# Altium schematic sheet Camera_Shield_Headers.SchDoc: Shield Headers
size B; CompanyName: Cospan Design; DrawnBy: David McCoy; Engineer: David McCoy; Organization: Cospan Design; DocumentNumber: 2; Revision: .revision; SheetNumber: 2; SheetTotal: 4
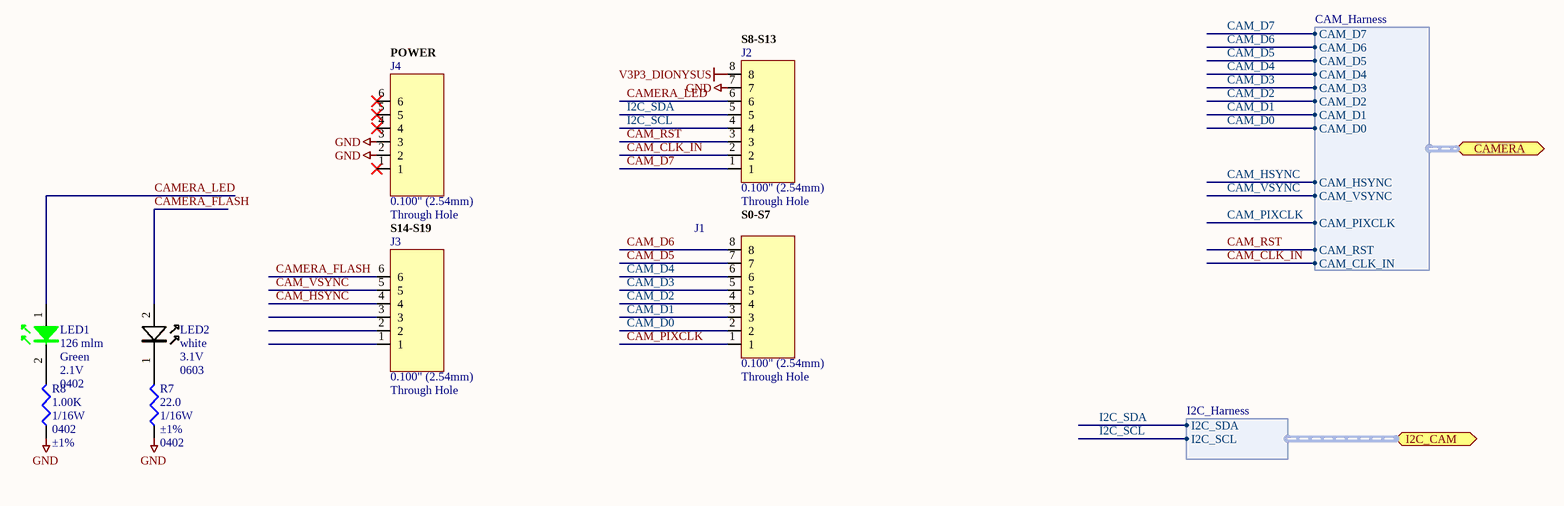
[diagram p0: Camera_Shield_Headers.SchDoc]

## Parts
J1  Pitch: 0.100" (2.54mm)  Mounting Type: Through Hole  [HDR_1X8]  (hidden comment: J_HDR1X8_THRHOLE_VERT)
J2  Pitch: 0.100" (2.54mm)  Mounting Type: Through Hole  [HDR_1X8]  (hidden comment: J_HDR1X8_THRHOLE_VERT)
J3  Pitch: 0.100" (2.54mm)  Mounting Type: Through Hole  [HDR_1X6]  (hidden comment: J_HDR1X6_THRHOLE_VERT)
J4  Pitch: 0.100" (2.54mm)  Mounting Type: Through Hole  [HDR_1X6]  (hidden comment: J_HDR1X6_THRHOLE_VERT)
LED1  Luminous Flux @ Current - Test: 126 mlm  Color: Green  Voltage - Forward (Vf) Typ: 2.1V  Package / Case: 0402  [DIOM1005X07L_GREEN]  (hidden comment: LED_GRN_0402)
LED2  Color: white  Voltage - Forward (Vf) Typ: 3.1V  Package / Case: 0603  [DIOM0603]  (hidden comment: LED_WHITE_0603)
R7  Resistance In Ohms: 22.0  Power (Watts): 1/16W  Tolerance: ±1%  Case: 0402  [ERA-0402]  (hidden comment: R_0402_22.0)
R8  Resistance In Ohms: 1.00K  Power (Watts): 1/16W  Case: 0402  Tolerance: ±1%  [ERA-0402]  (hidden comment: 1.0k Ohms)

## Ports
CAMERA (harness CAM_Harness), I2C_CAM (harness I2C_Harness)

## Harnesses
I2C_Harness: I2C_SDA, I2C_SCL
CAM_Harness: CAM_D7, CAM_D6, CAM_D5, CAM_D4, CAM_D3, CAM_D2, CAM_D1, CAM_D0, CAM_HSYNC, CAM_VSYNC, CAM_PIXCLK, CAM_RST, CAM_CLK_IN

## Nets
GND: J2.7 J4.2 J4.3 R7.2 R8.2
V3P3_DIONYSUS: J2.8
CAM_CLK_IN: J2.2 ; port CAMERA.CAM_CLK_IN
CAM_D0: J1.2 ; port CAMERA.CAM_D0
CAM_D1: J1.3 ; port CAMERA.CAM_D1
CAM_D2: J1.4 ; port CAMERA.CAM_D2
CAM_D3: J1.5 ; port CAMERA.CAM_D3
CAM_D4: J1.6 ; port CAMERA.CAM_D4
CAM_D5: J1.7 ; port CAMERA.CAM_D5
CAM_D6: J1.8 ; port CAMERA.CAM_D6
CAM_D7: J2.1 ; port CAMERA.CAM_D7
CAM_HSYNC: J3.4 ; port CAMERA.CAM_HSYNC
CAM_PIXCLK: J1.1 ; port CAMERA.CAM_PIXCLK
CAM_RST: J2.3 ; port CAMERA.CAM_RST
CAM_VSYNC: J3.5 ; port CAMERA.CAM_VSYNC
CAMERA_FLASH: J3.6 LED2.2
CAMERA_LED: J2.6 LED1.1
I2C_SCL: J2.4 ; port I2C_CAM.I2C_SCL
I2C_SDA: J2.5 ; port I2C_CAM.I2C_SDA
NetLED1_2: LED1.2 R8.1
NetLED2_1: LED2.1 R7.1

Not connected (* = marked no-connect by the designer): J3 1 2 3; J4 1* 4* 5* 6*

## Notes on the sheet
- (near J2) S8-S13
- (near J4) POWER
- S14-S19
- S0-S7
- Title:
- http://www.cospandesign.com
- Cospan Design
- Project:
- Document:
- Engineer:
- Drawn By:
- Approved By:
- Revision:
- Date:
- Number:
- of

## Library data of the parts
J1 J2 = J_HDR1X8_THRHOLE_VERT: CONN HEADER .100" 12POS TIN PCB; Manufacturer: Samtec; Manufacturer Part Number: TS-108-T-A; Connector Type: Unshrouded; Number of Positions: 8; Number of Positions Loaded: All; Supplier 1: Samtec Inc; Supplier Part Number 1: TS-108-T-A; RoHS: RoHS Compliant; Category: Connectors, Interconnects; Stock 1: 764; Number of Rows: 1; Row Spacing: -; Height Stacking (Mating): -; Height Above Board: 0.100" (2.54mm); Contact Mating Length: 0.166" (4.22mm); Termination: Solder; Contact Finish: Tin; Contact Finish Thickness: 200µin (5.08µm); Features: -; Color: Black; Packaging: Bulk; ComponentLink1URL: http://www.samtec.com/ftppub/cpdf/TX-MKT1.PDF; ComponentLink1Description: http://www.samtec.com/ftppub/cpdf/TX-MKT1.PDF
J3 J4 = J_HDR1X6_THRHOLE_VERT: CONN HEADER .100" 12POS TIN PCB; Manufacturer: Samtec; Manufacturer Part Number: TSW-106-07-T-S; Connector Type: Unshrouded; Number of Positions: 6; Number of Positions Loaded: All; Supplier 1: Samtec; Supplier Part Number 1: TSW-106-07-T-S; RoHS: RoHS Compliant; Category: Connectors, Interconnects; Stock 1: 0; Number of Rows: 1; Row Spacing: -; Height Stacking (Mating): -; Height Above Board: 0.100" (2.54mm); Contact Mating Length: 0.166" (4.22mm); Termination: Solder; Contact Finish: Tin; Contact Finish Thickness: 200µin (5.08µm); Features: -; Color: Black; Packaging: Bulk; ComponentLink1URL: http://www.samtec.com/ftppub/cpdf/TX-MKT1.PDF; ComponentLink1Description: http://www.samtec.com/ftppub/cpdf/TX-MKT1.PDF; Molding Height Above Board: 0.100" (2.54mm); ComponentLink2URL: http://www.samtec.com/ftppub/pdf/TD.PDF; ComponentLink2Description: http://www.samtec.com/ftppub/pdf/TD.PDF
LED1 = LED_GRN_0402: LED 1X0.5MM 570NM GN WTR CLR SMD; Manufacturer: Kingbright Corp; Manufacturer Part Number: APHHS1005CGCK; Current - Test: 20mA; Wavelength - Peak: 574nm; Millicandela Rating: 40mcd; Lens Type: Clear; Lens Style/Size: Rectangle, 0.8mm x 0.5mm; Viewing Angle: 120°; Supplier 1: Digi-Key; Supplier Part Number 1: 754-1101-1-ND; RoHS: RoHS Compliant; Category: Optoelectronics; Stock 1: 3400; Pricing: 1=0.24, 10=0.176, 25=0.1412, 100=0.1293, 250=0.11752, 500=0.10576, 1000=0.094 (USD); Wavelength - Dominant: 570nm; Mounting Type: Surface Mount; Packaging: Cut Tape (CT); Size / Dimension: *; Height: *; ComponentLink1URL: http://www.us.kingbright.com/images/catalog/SPEC/APHHS1005CGCK.pdf; ComponentLink1Description: http://www.us.kingbright.com/images/catalog/SPEC/APHHS1005CGCK.pdf
LED2 = LED_WHITE_0603: LED SMARTLED WHITE DIFF 0603 SMD; Manufacturer: OSRAM Opto Semiconductors Inc; Manufacturer Part Number: LW L283-P2R1-3K8L-1-Z; Millicandela Rating: 98mcd; Current - Test: 10mA; Wavelength - Dominant: 6200K; Viewing Angle: 170°, 130°; Lens Type: Diffused, Tinted; Lens Style/Size: Rectangle with Flat Top, 1.3mm x 0.8mm; Luminous Flux @ Current - Test: 400 mlm; Supplier 1: Digi-Key; Supplier Part Number 1: 475-1276-1-ND; RoHS: RoHS Compliant; Category: Optoelectronics; Stock 1: 27465; Pricing: 1=0.81, 10=0.673, 100=0.5382, 250=0.47092, 500=0.43056 (USD); Wavelength - Peak: -; Size / Dimension: 1.70mm L x 0.80mm W; Height: 0.65mm; Mounting Type: Surface Mount; Packaging: Cut Tape (CT); ComponentLink1URL: http://catalog.osram-os.com/catalogue/catalogue.do;jsessionid=AF97B8B46DD4D119AC14D4A83EF7134D?act=downloadFile&favOid=020000010003e856000100b6; ComponentLink1Description: http://catalog.osram-os.com/catalogue/catalogue.do;jsessionid=AF97B8B46DD4D119AC14D4A83EF7134D?act=downloadFile&favOid=020000010003e856000100b6
R7 = R_0402_22.0: RES 22.0 OHM 1/16W 1% 0402 SMD; Manufacturer: Vishay Dale; Manufacturer Part Number: CRCW040222R0FKED; Temperature Coefficient: ±100ppm/°C; Resistance (Ohms): 22; Supplier 1: Digi-Key; RoHS: RoHS Compliant; Category: Resistors; Stock 1: 175399; Pricing: 10=0.083, 50=0.0444, 200=0.0255, 1000=0.0174 (USD); Composition: Thick Film; Features: -; Size / Dimension: 0.039" L x 0.020" W (1.00mm x 0.50mm); Height: 0.016" (0.40mm); Packaging: Cut Tape (CT); ComponentLink1URL: http://www.vishay.com/doc?20035; ComponentLink1Description: http://www.vishay.com/doc?20035; Supplier Part Number 1: 541-22.0LCT-ND; Package / Case: 0402 (1005 Metric); Number of Terminations: 2
R8 = R_0402_1.0K: RES 1.00K OHM 1/16W 1% 0402 SMD; Manufacturer: Yageo; Manufacturer Part Number: RC0402FR-071KL; Resistance (Ohms): 1K; Temperature Coefficient: ±100ppm/°C; Supplier 1: Digi-Key; Supplier Part Number 1: 311-1.00KLRCT-ND; RoHS: RoHS Compliant; Category: Resistors; Stock 1: 2103351; Pricing: 10=0.014, 100=0.0063, 500=0.00382, 1000=0.0027, 5000=0.00203 (USD); Composition: Thick Film; Features: -; Package / Case: 0402 (1005 Metric); Size / Dimension: 0.039" L x 0.020" W (1.00mm x 0.50mm); Height: 0.016" (0.40mm); Number of Terminations: 2; Packaging: Cut Tape (CT); ComponentLink1URL: http://www.yageo.com/documents/recent/PYu-RC0402_51_RoHS_L_6.pdf; ComponentLink1Description: http://www.yageo.com/documents/recent/PYu-RC0402_51_RoHS_L_6.pdf